# EAGLE design panel446 (EAGLE 7.5.0)

## Sheet 1 of 4: MAIN
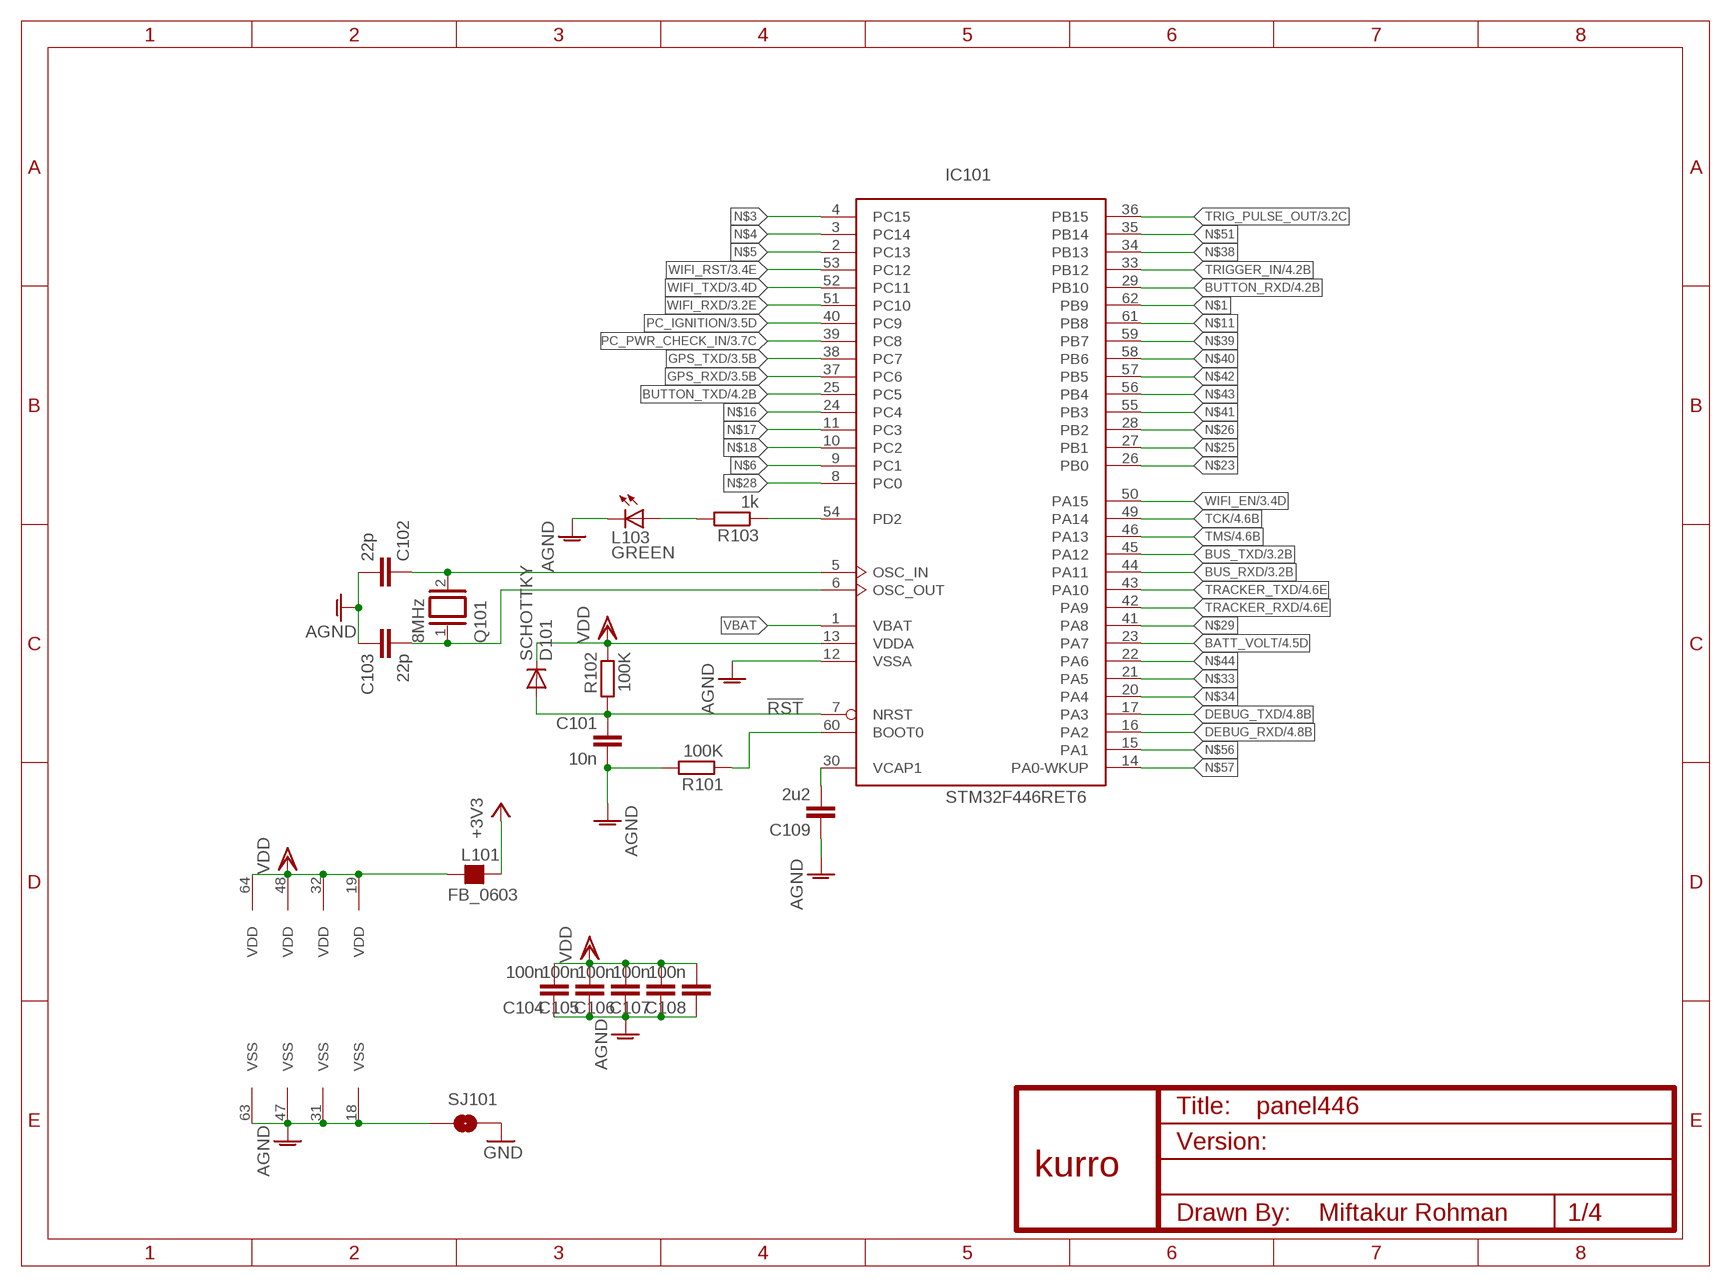
[diagram p0: schematic, sheet 1]

### Parts
C101  10n  C-EUC0603  [C0603]
C102  22p  C-EUC0603  [C0603]
C103  22p  C-EUC0603  [C0603]
C104  100n  C-EUC0603  [C0603]
C105  100n  C-EUC0603  [C0603]
C106  100n  C-EUC0603  [C0603]
C107  100n  C-EUC0603  [C0603]
C108  100n  C-EUC0603  [C0603]
C109  2u2  C-EUC0805  [C0805]
D101  SCHOTTKY  DIODE-MICROMELF-W  [MICROMELF-W]
IC101  STM32F446RET6  STM32F401RBT  [LQFP64]
L101  FB_0603  [L0603]
L103  GREEN  LEDCHIP-LED0805  [CHIP-LED0805]
Q101  8MHz  XTAL/S  [QS]
R101  100K  R-EU_R0603  [R0603]
R102  100K  R-EU_R0603  [R0603]
R103  1k  R-EU_R0603  [R0603]
SJ101  SOLDERJUMPERTRACE  [SJ_2S-TRACE]
U$1  KURRO_FOOTPRINT  [KURRO-LOGO]

### Nets
!RST [ic]: C101.1 D101.A IC101.7(NRST) R102.2 ; also sheet 4
+3V3: L101.2 ; also sheet 2,4
AGND [ic]: C101.2 C102.2 C103.1 C104.1 C105.1 C106.1 C107.1 C108.1 C109.1 IC101.12(VSSA) IC101.18(VSS) IC101.31(VSS) IC101.47(VSS) IC101.63(VSS) L103.C R101.2 SJ101.1 ; also sheet 3,4
BATT_VOLT [ic]: IC101.23(PA7) ; also sheet 4
BOOT1 [ic]: IC101.60(BOOT0) R101.1
BUS_RXD [ic]: IC101.44(PA11) ; also sheet 3
BUS_TXD [ic]: IC101.45(PA12) ; also sheet 3
BUTTON_RXD [ic]: IC101.29(PB10) ; also sheet 4
BUTTON_TXD [ic]: IC101.25(PC5) ; also sheet 4
DEBUG_RXD [ic]: IC101.16(PA2) ; also sheet 4
DEBUG_TXD [ic]: IC101.17(PA3) ; also sheet 4
GND: SJ101.2 ; also sheet 2,3,4
GPS_RXD [ic]: IC101.37(PC6) ; also sheet 3
GPS_TXD [ic]: IC101.38(PC7) ; also sheet 3
N$1 [ic]: IC101.62(PB9)
N$2 [ic]: C109.2 IC101.30(VCAP1)
N$3 [ic]: IC101.4(PC15)
N$4 [ic]: IC101.3(PC14)
N$5 [ic]: IC101.2(PC13)
N$6 [ic]: IC101.9(PC1)
N$11 [ic]: IC101.61(PB8)
N$16 [ic]: IC101.24(PC4)
N$17 [ic]: IC101.11(PC3)
N$18 [ic]: IC101.10(PC2)
N$19 [ic]: IC101.54(PD2) R103.1
N$20 [ic]: L103.A R103.2
N$23 [ic]: IC101.26(PB0)
N$24 [ic]: C103.2 IC101.6(OSC_OUT) Q101.1
N$25 [ic]: IC101.27(PB1)
N$26 [ic]: IC101.28(PB2)
N$28 [ic]: IC101.8(PC0)
N$29 [ic]: IC101.41(PA8)
N$31 [ic]: C102.1 IC101.5(OSC_IN) Q101.2
N$33 [ic]: IC101.21(PA5)
N$34 [ic]: IC101.20(PA4)
N$38 [ic]: IC101.34(PB13)
N$39 [ic]: IC101.59(PB7)
N$40 [ic]: IC101.58(PB6)
N$41 [ic]: IC101.55(PB3)
N$42 [ic]: IC101.57(PB5)
N$43 [ic]: IC101.56(PB4)
N$44 [ic]: IC101.22(PA6)
N$51 [ic]: IC101.35(PB14)
N$56 [ic]: IC101.15(PA1)
N$57 [ic]: IC101.14(PA0-WKUP)
PC_IGNITION [ic]: IC101.40(PC9) ; also sheet 3
PC_PWR_CHECK_IN [ic]: IC101.39(PC8) ; also sheet 3
TCK [ic]: IC101.49(PA14) ; also sheet 4
TMS [ic]: IC101.46(PA13) ; also sheet 4
TRACKER_RXD [ic]: IC101.42(PA9) ; also sheet 4
TRACKER_TXD [ic]: IC101.43(PA10) ; also sheet 4
TRIG_PULSE_OUT [ic]: IC101.36(PB15) ; also sheet 3
TRIGGER_IN [ic]: IC101.33(PB12) ; also sheet 4
VBAT [ic]: IC101.1(VBAT)
VDD [ic]: C104.2 C105.2 C106.2 C107.2 C108.2 D101.C IC101.13(VDDA) IC101.19(VDD) IC101.32(VDD) IC101.48(VDD) IC101.64(VDD) L101.1 R102.1 ; also sheet 3,4
WIFI_EN [ic]: IC101.50(PA15) ; also sheet 3
WIFI_RST [ic]: IC101.53(PC12) ; also sheet 3
WIFI_RXD [ic]: IC101.51(PC10) ; also sheet 3
WIFI_TXD [ic]: IC101.52(PC11) ; also sheet 3

## Sheet 2 of 4
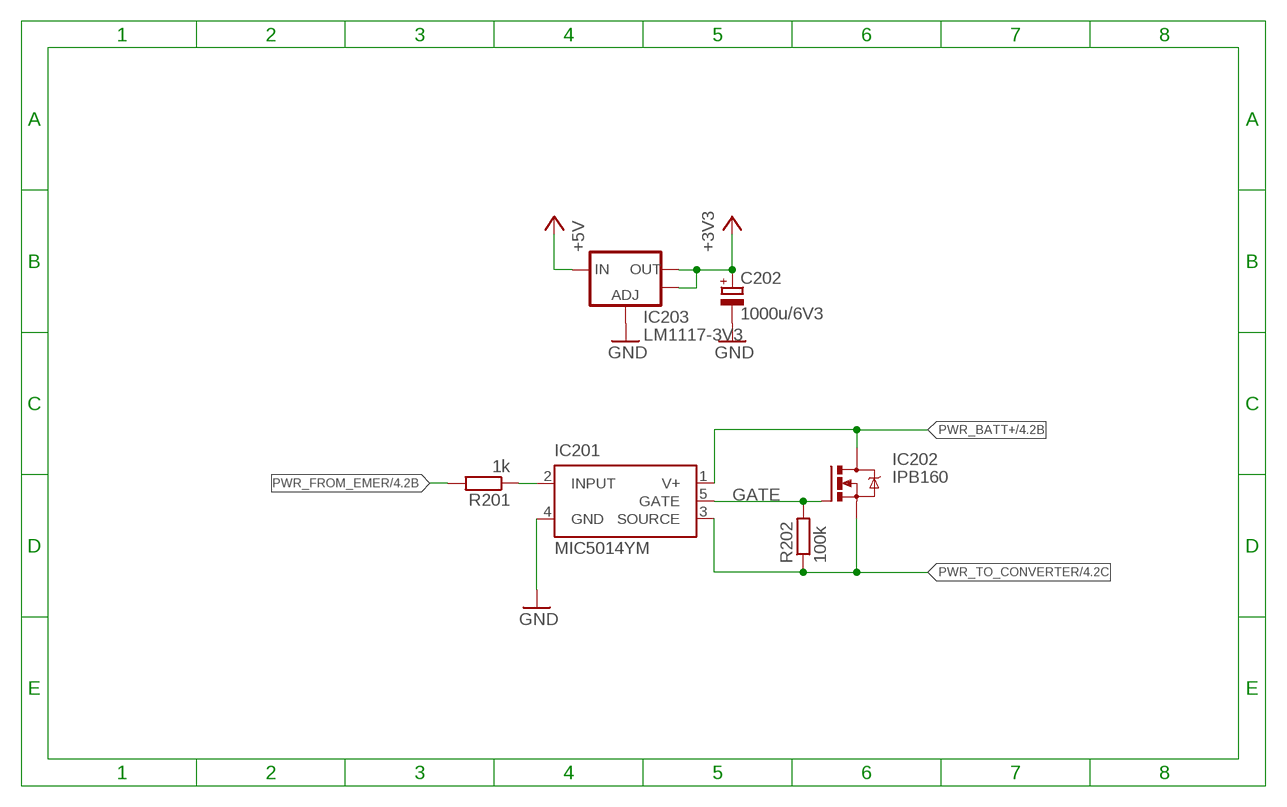
[diagram p1: schematic, sheet 2]

### Parts
C202  1000u/6V3  CPOL-EU153CLV-0810  [153CLV-0810]
IC201  MIC5014YM  [SO-08]
IC202  IPB160  [PG-TO263-7]
IC203  LM1117-3V3  V_REG_LM1117SOT223  [SOT223]
R201  1k  R-EU_R0603  [R0603]
R202  100k  R-EU_R0603  [R0603]

### Nets
+3V3: C202.+ IC203.2(OUT) IC203.4(OUT) ; also sheet 1,4
+5V: IC203.3(IN) ; also sheet 3,4
GATE: IC201.5(GATE) IC202.1(G) R202.2
GND: C202.- IC201.4(GND) IC203.1(ADJ) ; also sheet 1,3,4
N$69: IC201.2(INPUT) R201.1
PWR_BATT+ [power]: IC201.1(V+) IC202.4(D) ; also sheet 4
PWR_FROM_EMER [power]: R201.2 ; also sheet 4
PWR_TO_CONVERTER [power]: IC201.3(SOURCE) IC202.2(S) IC202.3(S) IC202.5(S) IC202.6(S) IC202.7(S) R202.1 ; also sheet 4

## Sheet 3 of 4
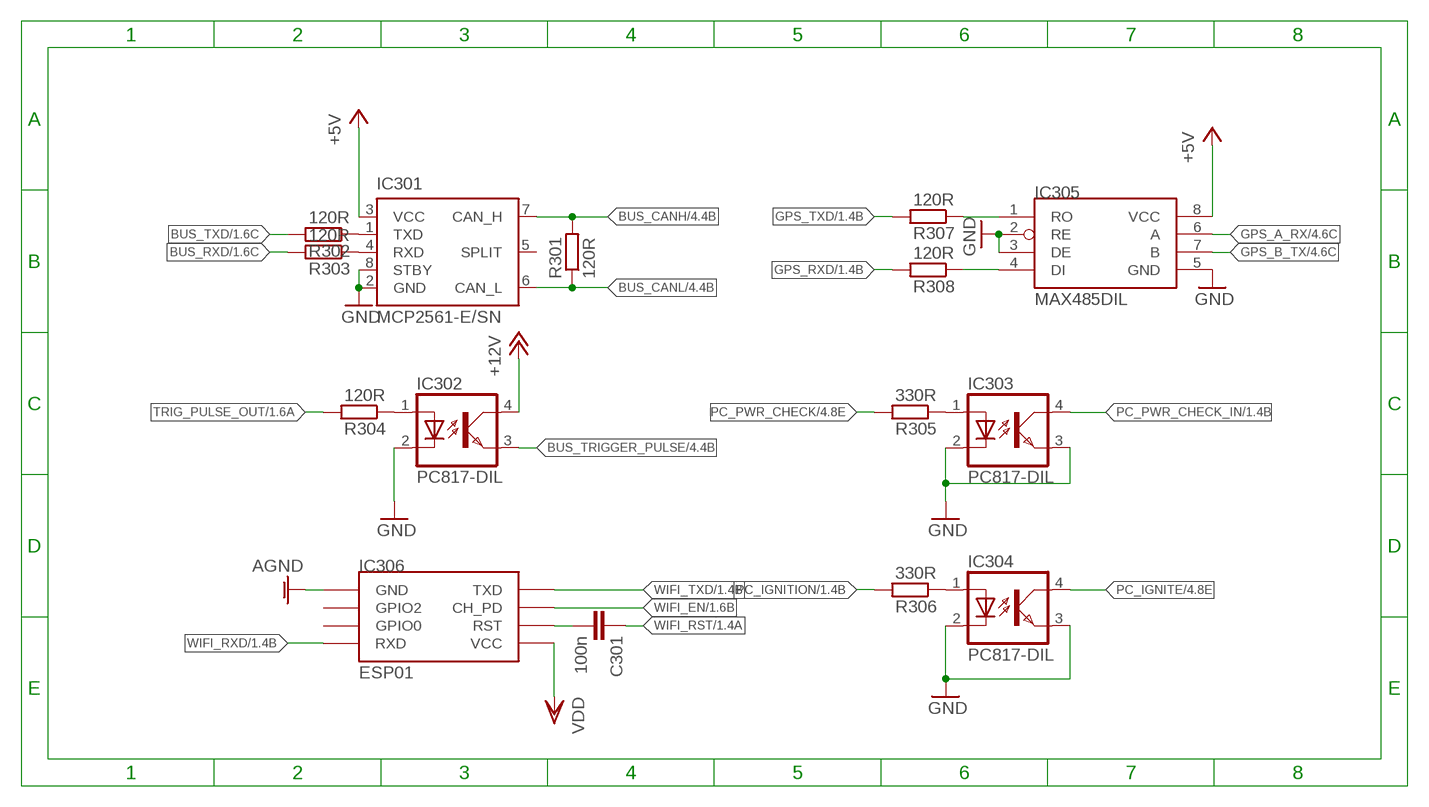
[diagram p2: schematic, sheet 3]

### Parts
C301  100n  C-EUC0603  [C0603]
IC301  MCP2561-E/SN  [SOIC-8]
IC302  PC817-DIL  [DIL04A]
IC303  PC817-DIL  [DIL04A]
IC304  PC817-DIL  [DIL04A]
IC305  MAX485DIL  [DIL08]
IC306  ESP01  [ESP01]
R301  120R  R-EU_R0603  [R0603]
R302  120R  R-EU_R0603  [R0603]
R303  120R  R-EU_R0603  [R0603]
R304  120R  R-EU_R0603  [R0603]
R305  330R  R-EU_R0603  [R0603]
R306  330R  R-EU_R0603  [R0603]
R307  120R  R-EU_R0603  [R0603]
R308  120R  R-EU_R0603  [R0603]

### Nets
+5V: IC301.3(VCC) IC305.8(VCC) ; also sheet 2,4
+12V [power]: IC302.4(COL) ; also sheet 4
AGND [ic]: IC306.GND ; also sheet 1,4
BUS_CANH: IC301.7(CAN_H) R301.2 ; also sheet 4
BUS_CANL: IC301.6(CAN_L) R301.1 ; also sheet 4
BUS_RXD [ic]: R303.2 ; also sheet 1
BUS_TRIGGER_PULSE: IC302.3(EMIT) ; also sheet 4
BUS_TXD [ic]: R302.2 ; also sheet 1
GND: IC301.2(GND) IC301.8(STBY) IC302.2(C) IC303.2(C) IC303.3(EMIT) IC304.2(C) IC304.3(EMIT) IC305.2(RE) IC305.3(DE) IC305.5(GND) ; also sheet 1,2,4
GPS_A_RX: IC305.6(A) ; also sheet 4
GPS_B_TX: IC305.7(B) ; also sheet 4
GPS_RXD [ic]: R308.2 ; also sheet 1
GPS_TXD [ic]: R307.2 ; also sheet 1
N$9: C301.2 IC306.RST
N$46: IC301.4(RXD) R303.1
N$49: IC301.1(TXD) R302.1
N$50: IC302.1(A) R304.1
N$58: IC303.1(A) R305.1
N$59: IC305.1(RO) R307.1
N$60: IC305.4(DI) R308.1
N$68: IC304.1(A) R306.1
PC_IGNITE: IC304.4(COL) ; also sheet 4
PC_IGNITION [ic]: R306.2 ; also sheet 1
PC_PWR_CHECK: R305.2 ; also sheet 4
PC_PWR_CHECK_IN [ic]: IC303.4(COL) ; also sheet 1
TRIG_PULSE_OUT [ic]: R304.2 ; also sheet 1
VDD [ic]: IC306.VCC ; also sheet 1,4
WIFI_EN [ic]: IC306.CH_PD ; also sheet 1
WIFI_RST [ic]: C301.1 ; also sheet 1
WIFI_RXD [ic]: IC306.RX(RXD) ; also sheet 1
WIFI_TXD [ic]: IC306.TX(TXD) ; also sheet 1
Unconnected: IC301.5(SPLIT) IC306.GPIO0 IC306.GPIO2

## Sheet 4 of 4: CONNECTOR
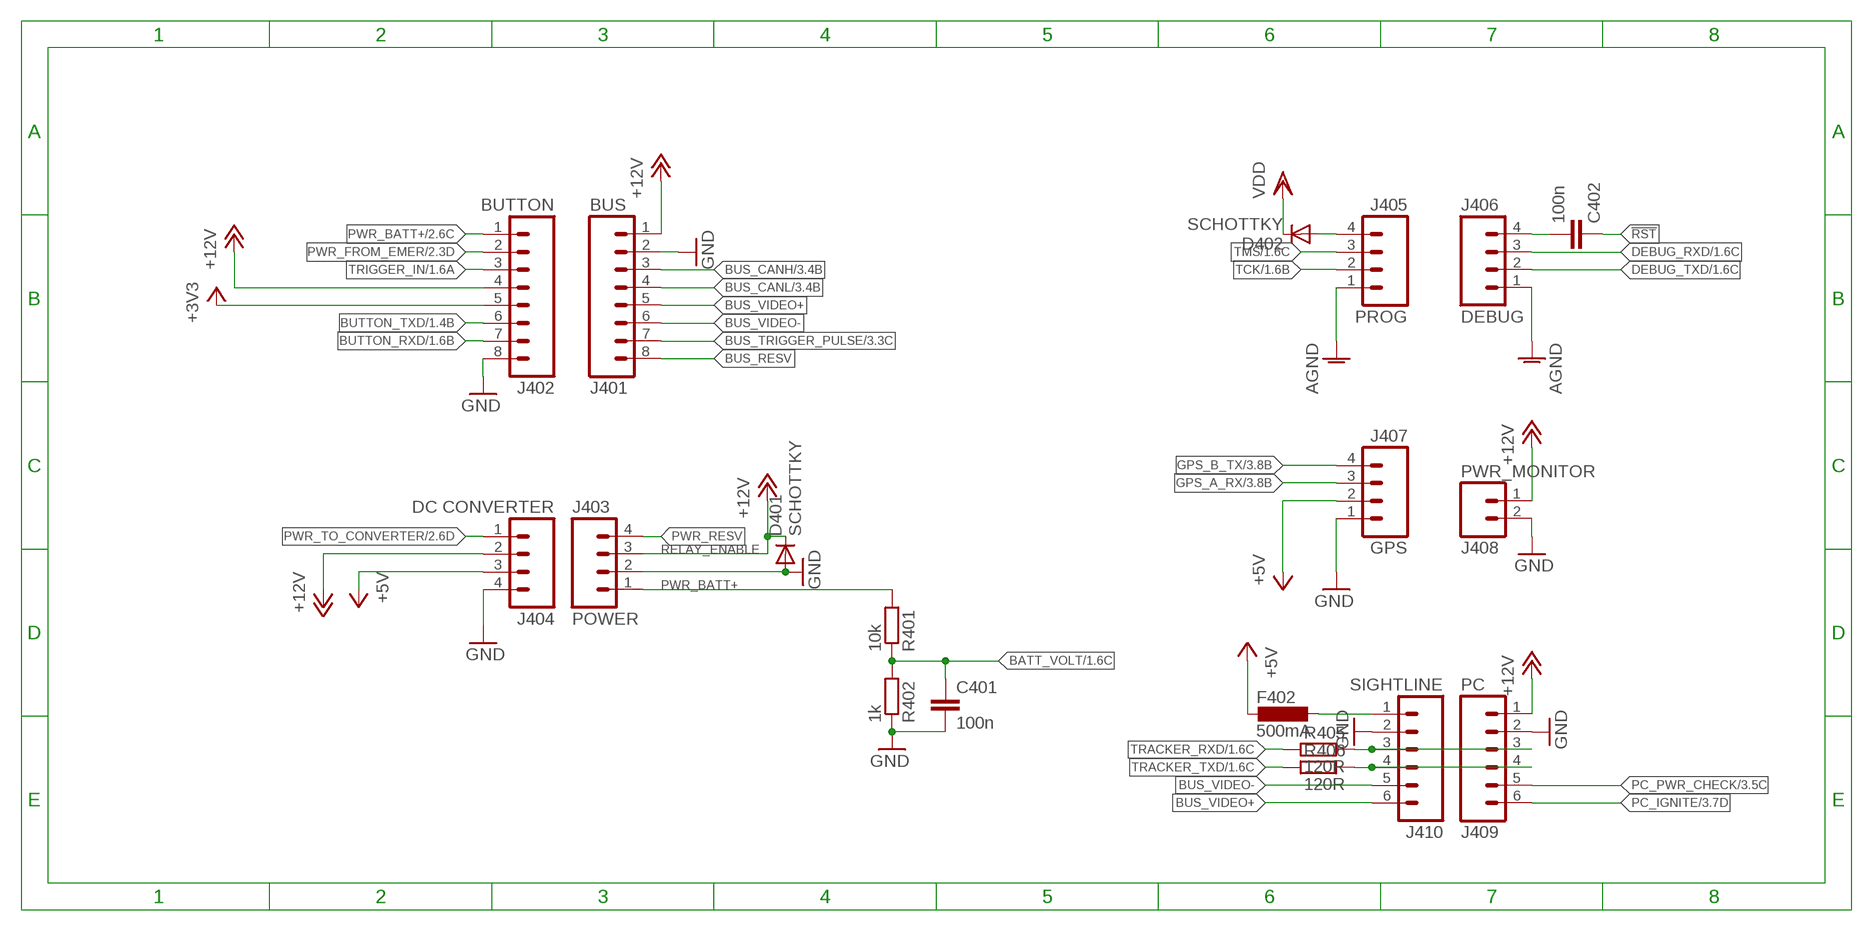
[diagram p3: schematic, sheet 4]

### Parts
C401  100n  C-EUC0603  [C0603]
C402  100n  C-EUC0603  [C0603]
D401  SCHOTTKY  DIODE-MICROMELF-W  [MICROMELF-W]
D402  SCHOTTKY  DIODE-MICROMELF-W  [MICROMELF-W]
F402  500mA  L-EUL0805  [L0805]
J401  BUS  M08-XH-VERT  [XH-8-VERT]
J402  BUTTON  M08-XH-VERT  [XH-8-VERT]
J403  POWER  M04-XH-VERT  [XH-4-VERT]
J404  DC CONVERTER  M04-XH-VERT  [XH-4-VERT]
J405  PROG  M04-XH-VERT  [XH-4-VERT]
J406  DEBUG  M04-XH-VERT  [XH-4-VERT]
J407  GPS  M04-XH-VERT  [XH-4-VERT]
J408  PWR_MONITOR  M02-XH-RA  [XH-2-RA]
J409  PC  M06-XH-VERT  [XH-6-VERT]
J410  SIGHTLINE  M06-XH-VERT  [XH-6-VERT]
R401  10k  R-EU_R0603  [R0603]
R402  1k  R-EU_R0603  [R0603]
R405  120R  R-EU_R0603  [R0603]
R406  120R  R-EU_R0603  [R0603]

### Nets
!RST [ic]: C402.1 ; also sheet 1
+3V3: J402.5 ; also sheet 1,2
+5V: F402.2 J404.3 J407.2 ; also sheet 2,3
+12V [power]: D401.C J401.1 J402.4 J403.3 J404.2 J408.1 J409.1 ; also sheet 3
AGND [ic]: J405.1 J406.1 ; also sheet 1,3
BATT_VOLT [ic]: C401.1 R401.1 R402.2 ; also sheet 1
BUS_CANH: J401.3 ; also sheet 3
BUS_CANL: J401.4 ; also sheet 3
BUS_RESV: J401.8
BUS_TRIGGER_PULSE: J401.7 ; also sheet 3
BUS_VIDEO+: J401.5 J410.6
BUS_VIDEO-: J401.6 J410.5
BUTTON_RXD [ic]: J402.7 ; also sheet 1
BUTTON_TXD [ic]: J402.6 ; also sheet 1
DEBUG_RXD [ic]: J406.3 ; also sheet 1
DEBUG_TXD [ic]: J406.2 ; also sheet 1
GND: C401.2 D401.A J401.2 J402.8 J403.2 J404.4 J407.1 J408.2 J409.2 J410.2 R402.1 ; also sheet 1,2,3
GPS_A_RX: J407.3 ; also sheet 3
GPS_B_TX: J407.4 ; also sheet 3
N$7: J409.3 J410.3 R405.1
N$8: J409.4 J410.4 R406.1
N$45: D402.A J405.4
N$61: C402.2 J406.4
N$65 [ic]: F402.1 J410.1
PC_IGNITE: J409.6 ; also sheet 3
PC_PWR_CHECK: J409.5 ; also sheet 3
PWR_BATT+ [power]: J402.1 J403.1 R401.2 ; also sheet 2
PWR_FROM_EMER [power]: J402.2 ; also sheet 2
PWR_RESV: J403.4
PWR_TO_CONVERTER [power]: J404.1 ; also sheet 2
TCK [ic]: J405.2 ; also sheet 1
TMS [ic]: J405.3 ; also sheet 1
TRACKER_RXD [ic]: R405.2 ; also sheet 1
TRACKER_TXD [ic]: R406.2 ; also sheet 1
TRIGGER_IN [ic]: J402.3 ; also sheet 1
VDD [ic]: D402.C ; also sheet 1,3

### Notes on the sheet
- RELAY_ENABLE

## Library data of the parts
C101-C108 C301 C401 C402 = resistor:C-EU: CAPACITOR, European symbol
C109 = rcl:C-EU: CAPACITOR, European symbol
C202 = resistor:CPOL-EU: POLARIZED CAPACITOR, European symbol
D101 D401 D402 = diode:DIODE-: DIODE
F402 = rcl:L-EU: INDUCTOR, European symbol
IC101 = micro-stm_v3:STM32F401R*T: ARM 32-bit Cortex™-M3 CPU 84 MHz maximum frequency 128 to 256 Kbytes of Flash memory 64 kbytes of SRAM 50 GPIOs 1.7 to 3.6 V application supply
IC201 = microchip:MIC501*
IC202 = infineon:IPB160: IPB160 TO-263-7
IC203 = SparkFun:V_REG_LM1117: Voltage Regulator LM1117 Standard adjustable voltage regulator but in SMD form. Spark Fun Electronics SKU : COM-00595
IC301 = microchip:MCP256*
IC302-IC304 = optocoupler:PC817: SHARP OPTO COUPLER
IC305 = SparkFun:MAX485
IC306 = esp8266modules:ESP01: ESP8266 Wifi module 01
J401 J402 = SparkFun-Connectors:M08: Header 8 Standard 8-pin 0.1" header. Use with straight break away headers (SKU : PRT-00116), right angle break away headers (PRT-00553), swiss pins (PRT-00743), machine pins (PRT-00117), and female headers (PRT-00115).
J403-J407 = SparkFun-Connectors:M04: Header 4 Standard 4-pin 0.1" header. Use with straight break away headers (SKU : PRT-00116), right angle break away headers (PRT-00553), swiss pins (PRT-00743), machine pins (PRT-00117), and female headers (PRT-00115). Molex polarized connector foot print use with SKU : PRT-08231 with associated crimp pins and housings. 1MM SMD Version SKU: PRT-10208
J408 = SparkFun-Connectors:M02: Standard 2-pin 0.1" header. Use with - straight break away headers ( PRT-00116) - right angle break away headers (PRT-00553) - swiss pins (PRT-00743) - machine pins (PRT-00117) - female headers (PRT-00115) Molex polarized connector foot print use with: PRT-08233 with associated crimp pins and housings. 2.54_SCREWTERM for use with PRT-10571. 3.5mm Screw Terminal footprints for PRT-08084 5mm Screw Terminal footprints for use with PRT-08433
J409 J410 = SparkFun-Connectors:M06: Header 6 Standard 6-pin 0.1" header. Use with straight break away headers (SKU : PRT-00116), right angle break away headers (PRT-00553), swiss pins (PRT-00743), machine pins (PRT-00117), and female headers (PRT-00115). Molex polarized connector foot print use with SKU : PRT-08094 with associated crimp pins and housings. NOTES ON THE VARIANTS LOCK and LOCK_LONGPADS... This footprint was designed to help hold the alignment of a through-hole component (i.e. 6-pin header) while soldering it into place. You may notice that each hole has been shifted either up or down by 0.005 of an inch from it's more standard position (which is a perfectly straight line). This slight alteration caused the pins (the squares in the middle) to touch the edges of the holes. Because they are alternating, it causes a "brace" to hold the component in place. 0.005 has proven to be the perfect amount of "off-center" position when using our standard breakaway headers. Although looks a little odd when you look at the bare footprint, once you have a header in there, the alteration is very hard to notice. Also,if you push a header all the way into place, it is covered up entirely on the bottom side. This idea of altering the position of holes to aid alignment will be further integrated into the Sparkfun Library for other footprints. It can help hold any component with 3 or more connection pins.
L101 = rc-master:FB_: FERRITE BEAD
L103 = led:LED: LED OSRAM: - CHIPLED LG R971, LG N971, LY N971, LG Q971, LY Q971, LO R971, LY R971 LH N974, LH R974 LS Q976, LO Q976, LY Q976 LO Q996 - Hyper CHIPLED LW Q18S LB Q993, LB Q99A, LB R99A - SideLED LS A670, LO A670, LY A670, LG A670, LP A670 LB A673, LV A673, LT A673, LW A673 LH A674 LY A675 LS A676, LA A676, LO A676, LY A676, LW A676 LS A679, LY A679, LG A679 - Hyper Micro SIDELED® LS Y876, LA Y876, LO Y876, LY Y876 LT Y87S - SmartLED LW L88C, LW L88S LB L89C, LB L89S, LG L890 LS L89K, LO L89K, LY L89K LS L896, LA L896, LO L896, LY L896 - TOPLED LS T670, LO T670, LY T670, LG T670, LP T670 LSG T670, LSP T670, LSY T670, LOP T670, LYG T670 LG T671, LOG T671, LSG T671 LB T673, LV T673, LT T673, LW T673 LH T674 LS T676, LA T676, LO T676, LY T676, LB T676, LH T676, LSB T676, LW T676 LB T67C, LV T67C, LT T67C, LS T67K, LO T67K, LY T67K, LW E67C LS E67B, LA E67B, LO E67B, LY E67B, LB E67C, LV E67C, LT E67C LW T67C LS T679, LY T679, LG T679 LS T770, LO T770, LY T770, LG T770, LP T770 LB T773, LV T773, LT T773, LW T773 LH T774 LS E675, LA E675, LY E675, LS T675 LS T776, LA T776, LO T776, LY T776, LB T776 LHGB T686 LT T68C, LB T68C - Hyper Mini TOPLED® LB M676 - Mini TOPLED Santana® LG M470 LS M47K, LO M47K, LY M47K Source: http://www.osram.convergy.de LUXEON: - LUMILED® LXK2-PW12-R00, LXK2-PW12-S00, LXK2-PW14-U00, LXK2-PW14-V00 LXK2-PM12-R00, LXK2-PM12-S00, LXK2-PM14-U00 LXK2-PE12-Q00, LXK2-PE12-R00, LXK2-PE12-S00, LXK2-PE14-T00, LXK2-PE14-U00 LXK2-PB12-K00, LXK2-PB12-L00, LXK2-PB12-M00, LXK2-PB14-N00, LXK2-PB14-P00, LXK2-PB14-Q00 LXK2-PR12-L00, LXK2-PR12-M00, LXK2-PR14-Q00, LXK2-PR14-R00 LXK2-PD12-Q00, LXK2-PD12-R00, LXK2-PD12-S00 LXK2-PH12-R00, LXK2-PH12-S00 LXK2-PL12-P00, LXK2-PL12-Q00, LXK2-PL12-R00 Source: www.luxeon.com KINGBRIGHT: KA-3528ASYC Source: www.kingbright.com
Q101 = special:XTAL/S: CRYSTAL
R101-R103 = resistor:R-EU_: RESISTOR, European symbol
R201 R202 R302 R303 R307 R308 R401 R402 R405 R406 = rcl:R-EU_: RESISTOR, European symbol
R301 R304-R306 = rcl:R-EU_: RESISTOR, European symbol; DNP: T
SJ101 = SparkFun:SOLDERJUMPER: Solder Jumper Standard SMD solder jumper. Used to automate production. Two varients : Normally Open and Normally Closed are the same, but have different paste layers. NC will have a large amount of paste and should jumper during reflow.; BOM: EXCLUDE; DNP: T
U$1 = SparkFun:KURRO_FOOTPRINT

## Net classes
0 default: width 0.406 mm, drill 0.59 mm, clearance 0.305 mm
1 ic: width 0.203 mm, drill 0.59 mm, clearance 0.203 mm
2 power: width 0.406 mm, drill 0.79 mm, clearance 0.406 mm

## Board
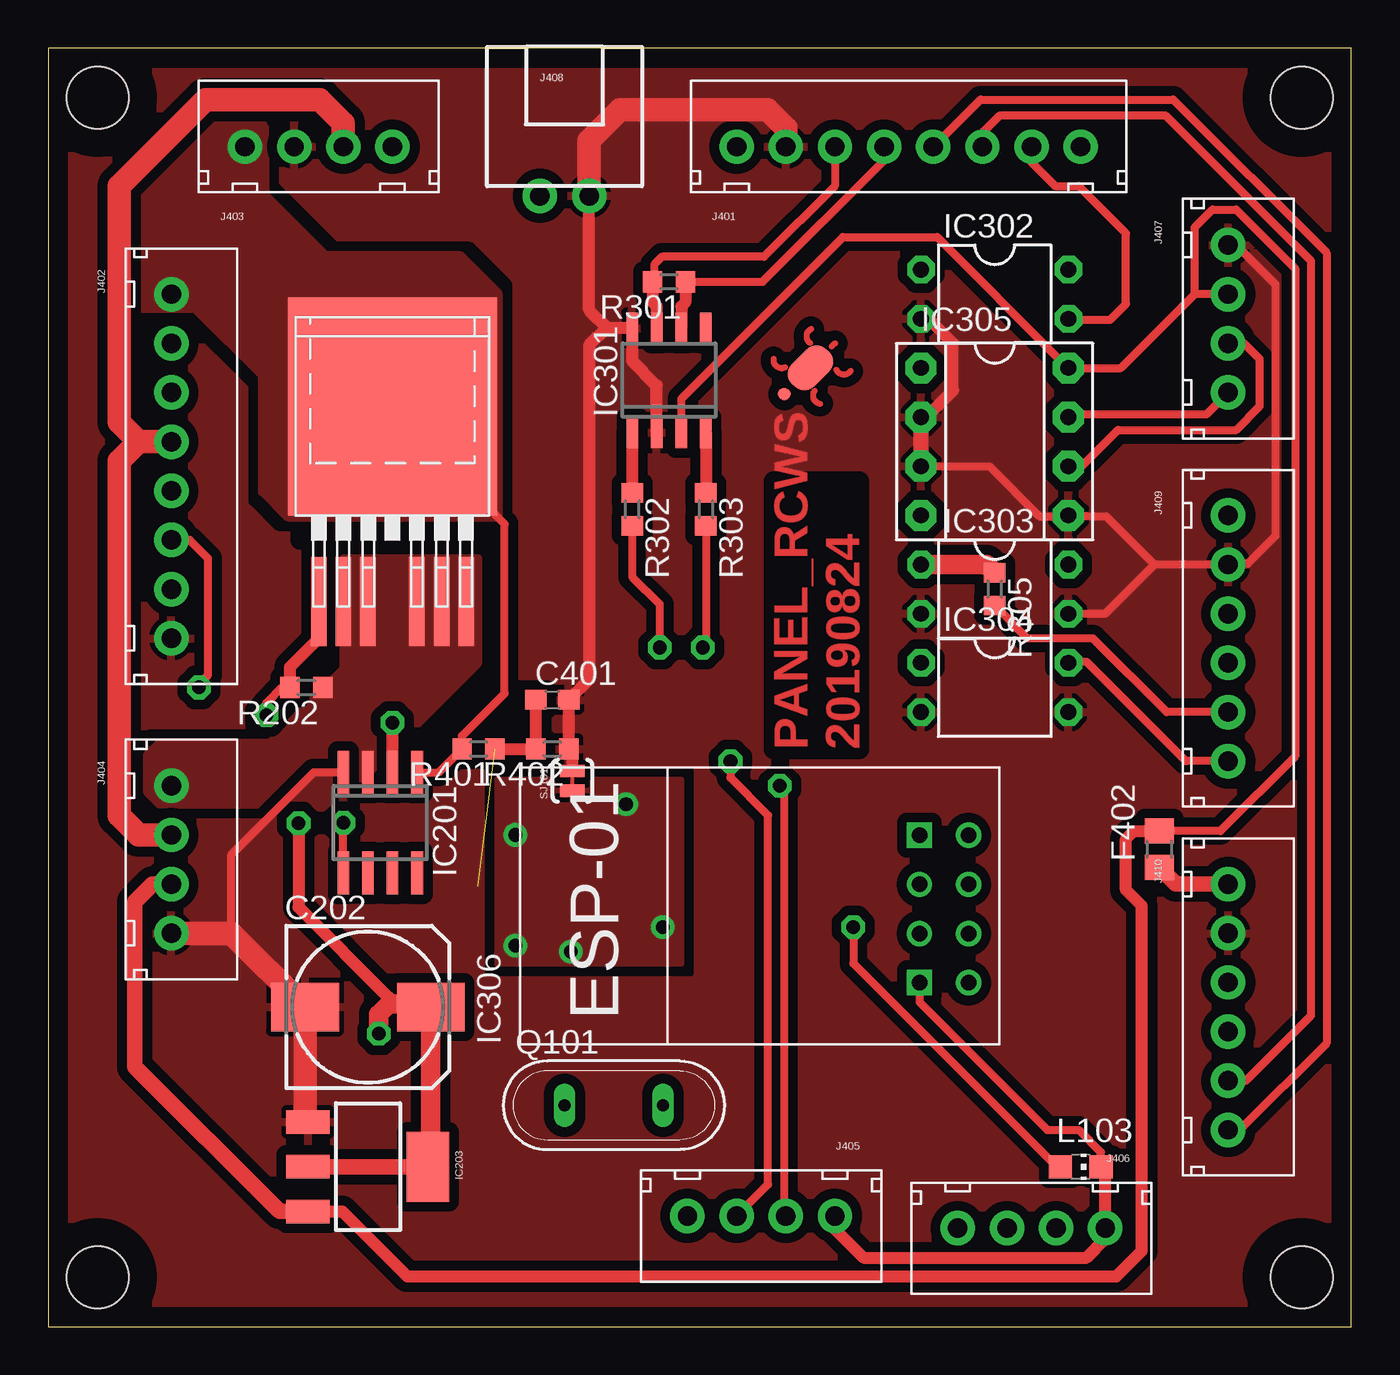
[diagram p4: board, top side]
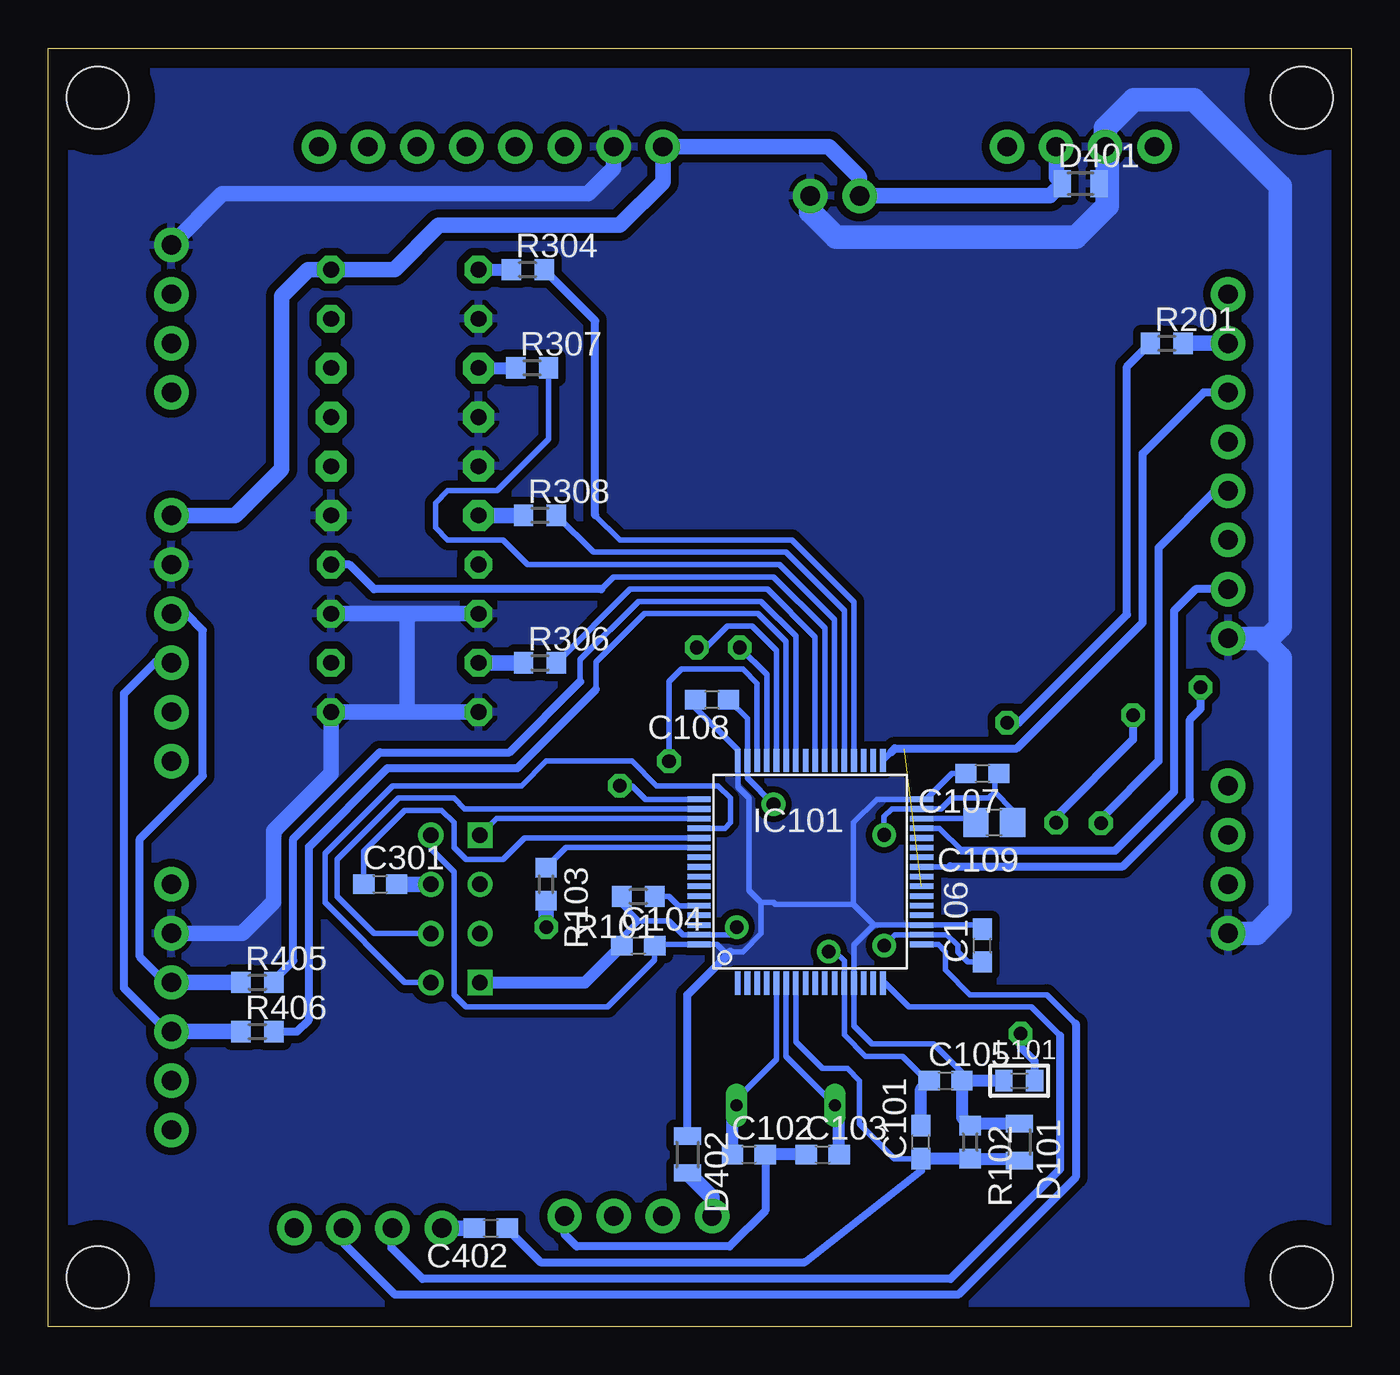
[diagram p5: board, bottom side, seen from below]

Size 67.31 x 66.04 mm. Coordinates in mm from the lower left corner, seen from the top.
Outline: 0,0 67.31,0 67.31,66.04 0,66.04 0,0
Copper layers (1*16): Top 0.035mm / dielectric 1.5mm / Bottom 0.035mm
Design rules "default": minimum track width 10mil, minimum drill 24mil, track to track 8mil, track to pad 8mil, pad to pad 8mil, via to via 8mil, smd to smd 8mil, copper to edge 40mil, drill to drill 8mil, minimum pad ring 10mil, minimum via ring 8mil, stop-mask expansion 4mil, vias tented up to drill 0mil, thermal gap 10mil
Holes 3.2 mm at 2.54,2.54 64.77,2.54 64.77,63.5 2.54,63.5
tRestrict: area 62.2,61 to 67.3,66; area 62.2,0 to 67.3,5.1; area 0,0 to 5.1,5.1; area 0,61 to 5.1,66; area 13,40.6 to 22.8,41
bRestrict: area 0,0 to 5.1,5.1; area 62.2,0 to 67.3,5.1; area 62.2,61 to 67.3,66; area 0,61 to 5.1,66

### Footprints (pad centres in the part's own frame; a part is rotated, then mirrored left to right if it is on the bottom)
C0603 = smd 1.1 x 1: 1 -0.85,0; 2 0.85,0
C0805 = smd 1.3 x 1.5: 1 -0.95,0; 2 0.95,0
153CLV-0810 = smd 3.5 x 2.5: + 3.25,0; - -3.25,0
MICROMELF-W = smd 0.9 x 1.4: A 0.95,0; C -0.95,0
L0805 = smd 1.3 x 1.5: 1 -0.95,0; 2 0.95,0
LQFP64 = smd 0.29 x 1.2: 1 -3.75,-5.75; 2 -3.25,-5.75; 3 -2.75,-5.75; 4 -2.25,-5.75; 5 -1.75,-5.75; 6 -1.25,-5.75; 7 -0.75,-5.75; 8 -0.25,-5.75; 9 0.25,-5.75; 10 0.75,-5.75; 11 1.25,-5.75; 12 1.75,-5.75; 13 2.25,-5.75; 14 2.75,-5.75; 15 3.25,-5.75; 16 3.75,-5.75; 33 3.75,5.75; 34 3.25,5.75; 35 2.75,5.75; 36 2.25,5.75; 37 1.75,5.75; 38 1.25,5.75; 39 0.75,5.75; 40 0.25,5.75; 41 -0.25,5.75; 42 -0.75,5.75; 43 -1.25,5.75; 44 -1.75,5.75; 45 -2.25,5.75; 46 -2.75,5.75; 47 -3.25,5.75; 48 -3.75,5.75 | smd 1.2 x 0.29: 17 5.75,-3.75; 18 5.75,-3.25; 19 5.75,-2.75; 20 5.75,-2.25; 21 5.75,-1.75; 22 5.75,-1.25; 23 5.75,-0.75; 24 5.75,-0.25; 25 5.75,0.25; 26 5.75,0.75; 27 5.75,1.25; 28 5.75,1.75; 29 5.75,2.25; 30 5.75,2.75; 31 5.75,3.25; 32 5.75,3.75; 49 -5.75,3.75; 50 -5.75,3.25; 51 -5.75,2.75; 52 -5.75,2.25; 53 -5.75,1.75; 54 -5.75,1.25; 55 -5.75,0.75; 56 -5.75,0.25; 57 -5.75,-0.25; 58 -5.75,-0.75; 59 -5.75,-1.25; 60 -5.75,-1.75; 61 -5.75,-2.25; 62 -5.75,-2.75; 63 -5.75,-3.25; 64 -5.75,-3.75
SO-08 = smd 0.6 x 2.2: 1 -1.905,-2.6; 2 -0.635,-2.6; 3 0.635,-2.6; 4 1.905,-2.6; 5 1.905,2.6; 6 0.635,2.6; 7 -0.635,2.6; 8 -1.905,2.6
PG-TO263-7 = smd 0.8 x 4.6: 1 -3.81,-4.45; 2 -2.54,-4.45; 3 -1.27,-4.45; 5 1.27,-4.45; 6 2.54,-4.45; 7 3.81,-4.45 | smd 10.8 x 11.25: 4 0,5.625
SOT223 = smd 1.219 x 2.235: 1 -2.311,-3.099; 2 0,-3.099; 3 2.311,-3.099 | smd 3.6 x 2.2: 4 0,3.099
SOIC-8 = smd 0.6 x 1.6: 1 -1.905,-2.7; 2 -0.635,-2.7; 3 0.635,-2.7; 4 1.905,-2.7; 5 1.905,2.7; 6 0.635,2.7; 7 -0.635,2.7; 8 -1.905,2.7
DIL04A = drill 0.813 pad 1.422 octagon: 1 -1.27,-3.81; 2 1.27,-3.81; 3 1.27,3.81; 4 -1.27,3.81
DIL08 = drill 0.813 pad 1.6 octagon: 1 -3.81,-3.81; 2 -1.27,-3.81; 3 1.27,-3.81; 4 3.81,-3.81; 5 3.81,3.81; 6 1.27,3.81; 7 -1.27,3.81; 8 -3.81,3.81
ESP01 = drill 0.8: CH_PD -1.285,-8.178; GPIO0 1.255,-5.638; GPIO2 -1.285,-5.638; RST 1.255,-8.178; TX -3.825,-8.178; VCC 3.795,-8.178 | drill 0.8 square: GND -3.825,-5.638; RX 3.795,-5.638
XH-8-VERT = drill 1 pad 1.778: 1 -8.89,0; 2 -6.35,0; 3 -3.81,0; 4 -1.27,0; 5 1.27,0; 6 3.81,0; 7 6.35,0; 8 8.89,0
XH-4-VERT = drill 1 pad 1.778: 1 -3.81,0; 2 -1.27,0; 3 1.27,0; 4 3.81,0
XH-2-RA = drill 1 pad 1.778: 1 -1.27,0; 2 1.27,0
XH-6-VERT = drill 1 pad 1.778: 1 -6.35,0; 2 -3.81,0; 3 -1.27,0; 4 1.27,0; 5 3.81,0; 6 6.35,0
L0603 = smd 0.9 x 1.1: 1 -0.794,0; 2 0.794,0
CHIP-LED0805 = smd 1.2 x 1.2: A 0,-1.05; C 0,1.05
QS = drill 0.61 long: 1 -2.54,0; 2 2.54,0
R0603 = smd 1 x 1.1: 1 -0.85,0; 2 0.85,0
SJ_2S-TRACE = smd 0.635 x 1.27: 1 -0.508,0; 2 0.508,0
KURRO-LOGO = smd 2.54 x 1.651 rotated 45 bottom: P$1 0,0 | smd 0.635 x 0.635 rotated 45 bottom: P$2 1.347,1.347

### Placement (x,y rotation side)
C101  22.23,9.53 90 bottom
C102  31.11,8.89 0 bottom
C103  27.3,8.89 0 bottom
C104  36.83,19.68 0 bottom
C105  20.95,12.7 0 bottom
C106  19.05,19.68 90 bottom
C107  19.05,28.57 180 bottom
C108  33.02,32.38 180 bottom
C109  18.44,26.04 180 bottom
C202  16.51,16.51 0 top
C301  50.16,22.86 0 bottom
C401  26.04,32.38 0 top
C402  44.45,5.08 180 bottom
D101  17.14,9.53 270 bottom
D401  13.97,59.05 0 bottom
D402  34.29,8.89 270 bottom
F402  57.4,24.66 90 top
IC101  27.94,23.5 0 bottom
IC201  17.14,26.04 180 top
IC202  17.78,41.91 0 top
IC203  16.51,8.26 270 top
IC301  32.07,48.9 0 top
IC302  48.9,53.34 270 top
IC303  48.9,38.1 270 top
IC304  48.9,33.02 270 top
IC305  48.9,45.72 270 top
IC306  39.37,21.59 90 top
J401  44.45,60.96 0 top
J402  6.35,44.45 270 top
J403  13.97,60.96 0 top
J404  6.35,24.13 270 top
J405  36.83,5.71 180 top
J406  50.8,5.08 180 top
J407  60.96,52.07 270 top
J408  26.67,58.42 0 top
J409  60.96,35.56 270 top
J410  60.96,16.51 270 top
L101  17.14,12.7 0 bottom
L103  53.34,8.26 270 top
Q101  29.21,11.43 0 top
R101  36.83,22.23 180 bottom
R102  19.68,9.53 270 bottom
R103  41.59,22.86 270 bottom
R201  9.53,50.8 0 bottom
R202  13.34,33.02 180 top
R301  32.07,53.98 180 top
R302  30.16,42.23 270 top
R303  33.97,42.23 270 top
R304  42.55,54.61 0 bottom
R305  48.9,38.1 270 top
R306  41.91,34.29 0 bottom
R307  42.32,49.53 0 bottom
R308  41.91,41.91 0 bottom
R401  22.23,29.84 180 top
R402  26.04,29.84 180 top
R405  56.52,17.78 0 bottom
R406  56.52,15.24 0 bottom
SJ101  27.08,28.19 90 top
U$1  39.37,49.53 270 bottom

### Tracks (layer width: path | path; a pad name or v marks a point on that pad's centre or on a via)
!RST
  Bottom 0.279: IC101.7 28.69,14.72 27.3,13.34 26.04,13.34 25.4,12.7 25.4,10.48 23.6,8.68 C101.1
  Bottom 0.406: C402.1 43.6,5.04 41.88,3.33 28.22,3.33 22.23,8.05 C101.1
  Bottom 0.61: D101.A 17.25,8.68 R102.2 C101.1
+3V3  (via drill 0.7 pad 1.22)
  Top 0.61: 17.61,16.66 17.61,16.99 12.93,21.68 v12.93,26.01
  Top 0.813: IC203.2 IC203.4 19.76,8.41
  Top 1.016: 19.76,8.41 C202.+ 19.61,16.66 17.61,16.66 17.07,16.12 v17.07,15.13
  Bottom 0.406: L101.2 16.35,13.71 17.07,14.43 v17.07,15.13 | J402.5 7.01,43.18 9.96,40.23 9.96,29.21 12.93,26.24 v12.93,26.01
+5V
  Top 0.406: IC301.3 32.7,47.94 41.05,56.29 45.92,56.29 52.22,49.99 52.25,49.99 IC305.8 55.42,49.53 59.23,53.34 | 59.23,53.34 59.23,56.79 60.15,57.71 61.37,57.71 64.41,54.66 64.41,29.46 60.55,25.6 57.41,25.6 F402.2 | J407.2 59.23,53.34
  Top 0.61: F402.2 56.08,25.6 55.68,25.2 55.68,22.55 56.49,21.74 56.49,3.91 55.17,2.59 18.54,2.59 15.19,5.94 IC203.3
  Top 0.813: J404.3 5.38,22.86 4.47,21.95 4.47,13.41 11.94,5.94 IC203.3
+12V
  Top 1.219: J404.2 4.67,25.4 3.66,26.42 3.66,44.7 4.67,45.72 | 4.67,45.72 3.66,46.74 3.66,58.93 8.13,63.4 14.02,63.4 15.24,62.18 J403.3 | 4.67,45.72 J402.4
  Bottom 0.813: J403.3 15.24,59.38 D401.C 15.55,58.42 J408.1 25.4,59.37 26.99,60.96 J401.1 35.56,59.13 37.8,56.9 47.14,56.9 49.43,54.61 IC302.4 53.9,54.61 55.27,53.24 55.27,44.3 57.66,41.91 J409.1
AGND  (via drill 0.7 pad 1.22)
  Top 0.406: IC306.GND 45.01,16.77 51.61,10.16 53.24,10.16 54.39,9.01 L103.C
  Top 0.61: J405.1 40.64,5.03 42.11,3.56 53.65,3.56 54.61,4.52 J406.1 54.61,8.04 L103.C
  Bottom 0.279: 36.83,20.95 35.24,20.95 34.53,20.25 IC101.63 32.14,20.25 v31.75,20.64 | 36.83,20.95 37.68,21.8 R101.2 | C104.1 37.68,20.11 36.83,20.95 | C106.1 19.79,18.84 20.32,19.37 20.32,19.68 20.88,20.25 IC101.18 23.57,20.25 v24.13,19.68 | v29.84,26.99 31.19,28.33 IC101.47 31.19,31.41 C108.1 | v24.13,25.4 24.13,26.35 23.74,26.75 IC101.31 21.2,26.75 20.64,27.3 18.73,27.3 18.41,27.62 | v26.99,19.37 26.67,19.37 26.19,18.89 IC101.12 26.19,15.08 25.08,13.97 23.18,13.97 21.91,12.7 C105.1 | 18.41,27.62 18.41,28.36 C107.1 | C109.1 17.49,26.7 18.41,27.62
  Bottom 0.406: C102.2 30.27,5.98 32.11,4.14 40.02,4.14 40.64,4.76 J405.1
  Bottom 0.61: C101.2 22.23,12.28 C105.1 | C104.1 39.6,17.77 IC306.GND | C103.1 C102.2
  pour Top (isolate 0.318, rank 5): 23.18,18.73 32.7,18.73 32.7,28.26 23.18,28.26
BATT_VOLT  (1 unrouted)
  Top 0.61: R401.1 R402.2 C401.1
BOOT1
  Bottom 0.279: IC101.60 34.76,21.75 35.24,22.23 R101.1
BUS_CANH
  Top 0.406: J401.3 40.64,58.93 36.98,55.27 31.7,55.27 31.29,54.86 31.29,54.05 R301.2
  Top 0.61: R301.2 31.22,52.92 31.43,52.7 IC301.7
BUS_CANL
  Top 0.406: J401.4 43.18,60.25 36.91,53.98 R301.1
  Top 0.61: R301.1 32.92,52.92 32.7,52.7 IC301.6
BUS_RXD  (via drill 0.7 pad 1.22)
  Top 0.406: R303.2 33.97,35.24 v33.81,35.08
  Bottom 0.279: IC101.44 29.69,34.93 30.96,36.2 32.23,36.2 33.34,35.08 v33.81,35.08
BUS_TRIGGER_PULSE
  Top 0.406: IC302.3 52.78,52.07 52.83,52.02 54.86,52.02 55.68,52.83 55.68,56.49 53.24,58.93 52.02,58.93 50.8,60.15 J401.7
BUS_TXD  (via drill 0.7 pad 1.22)
  Top 0.406: R302.2 30.16,38.73 31.59,37.31 v31.59,35.08
  Bottom 0.279: IC101.45 30.19,33.68 v31.59,35.08
BUS_VIDEO+
  Top 0.406: J401.5 48.16,63.4 58.12,63.4 66.04,55.47 66.04,14.63 61.57,10.16 J410.6
BUS_VIDEO-
  Top 0.406: J401.6 48.26,61.67 49.17,62.59 57.71,62.59 65.23,55.07 65.23,16.05 61.87,12.7 J410.5
BUTTON_RXD
  Bottom 0.279: IC101.29 21.27,25.75 20.12,24.59
  Bottom 0.406: 20.12,24.59 12.19,24.59 9.14,27.64 9.14,36.98 8.03,38.1 J402.7
BUTTON_TXD  (via drill 0.7 pad 1.22)
  Top 0.406: v7.78,33.02 7.78,33.18 8.26,33.66 8.26,39.69 7.3,40.64 J402.6
  Bottom 0.279: IC101.25 20.76,23.75 20.73,23.77
  Bottom 0.406: 20.73,23.77 11.79,23.77 8.33,27.23 8.33,31.36 7.78,31.91 v7.78,33.02
DEBUG_RXD
  Bottom 0.279: IC101.16 24.09,17.75 22.86,16.51 16.51,16.51 15.04,15.04
  Bottom 0.406: 15.04,15.04 15.04,8.13 20.7,2.46 47.98,2.46 49.58,4.06 49.58,5.03 J406.3
DEBUG_TXD
  Bottom 0.279: IC101.17 21.33,19.75 20.95,19.37 20.95,18.41 19.68,17.14 15.72,17.14 14.22,15.65
  Bottom 0.406: 14.22,15.65 14.22,7.72 20.3,1.65 49.4,1.65 52.02,4.27 52.02,5.03 J406.2
GATE  (via drill 0.7 pad 1.22)
  Top 0.406: IC201.5 v15.24,26.04 | R202.2 12.06,33.02 11.27,32.23 v11.27,31.59
  Top 0.61: IC202.1 13.97,35.56 12.48,34.08 R202.2
  Bottom 0.406: v11.27,31.59 11.27,30.32 15.24,26.35 v15.24,26.04
GND
  Top 0.406: J407.1 61.37,55.88 63.4,53.85 63.4,40.84 61.98,39.42 61.01,39.42 J409.2 57.15,39.37 | 57.15,39.37 54.66,41.86 52.76,41.86 IC305.5 52.65,41.86 51.21,41.86 48.62,44.45 IC305.3 | IC303.3 54.61,36.83 57.15,39.37 | 9.45,20.32 9.45,24.37 13.71,28.64 IC201.4
  Top 0.61: 28.85,51.61 27.94,52.53 27.94,58.93 | 28.85,51.61 27.94,50.7 27.94,33.44 C401.2 R402.1 27.08,29.65 SJ101.2 | 28.85,51.61 30.14,51.61 IC301.8 30.16,49.9 31.43,48.63 IC301.2 | IC305.2 45.36,46.99 46.74,48.36 46.74,50.8 45.47,52.07 IC302.2
  Top 0.813: IC305.2 IC305.3
  Top 1.219: J408.2 27.94,58.93 27.94,61.28 29.53,62.87 37.15,62.87 38.1,61.91 J401.2 | J404.4 9.45,20.32 C202.- 13.26,10.72 IC203.1
  Bottom 0.61: D401.A 12.88,59.05
  Bottom 0.813: J403.2 12.7,59.38 D401.A | J410.2 57.3,20.32 55.68,21.95 55.68,25.6 52.7,28.57 IC304.3 48.77,31.75 | 48.77,31.75 IC304.2 | IC303.3 IC303.2 48.51,36.83 48.77,36.58 48.77,31.75 | J401.2 38.1,59.84 39.42,58.52 58.32,58.52 J407.1
  Bottom 1.219: J404.4 4.88,20.32 3.66,21.54 3.66,34.54 4.67,35.56 J402.8 4.27,35.56 3.66,36.17 3.66,58.93 8.13,63.4 11.21,63.4 12.7,61.91 J403.2 12.6,60.86 12.6,57.91 14.22,56.29 26.62,56.29 27.94,57.61 J408.2
  pour Top (isolate 0.508, rank 6): 0,0 67.31,0 67.31,66.04 0,66.04
  pour Bottom (isolate 0.406, rank 6): 0,0 67.31,0 67.31,66.04 0,66.04
GPS_A_RX
  Top 0.406: IC305.6 53.39,44.45 55.27,46.33 61.37,46.33 62.59,47.55 62.59,49.99 61.77,50.8 J407.3
GPS_B_TX
  Top 0.406: IC305.7 52.7,47.02 52.83,47.14 59.84,47.14 J407.4
GPS_RXD
  Bottom 0.279: IC101.37 26.19,36.98 29.21,40.01 39.16,40.01 R308.2
GPS_TXD
  Bottom 0.279: IC101.38 26.69,36.53 29.53,39.37 42.55,39.37 43.81,40.64 46.67,40.64 47.31,41.27 47.31,42.55 46.67,43.18 44.13,43.18 41.47,45.85 R307.2
N$2
  Bottom 0.279: IC101.30 19.6,26.25 C109.2
N$7
  Bottom 0.406: J410.3 61.27,17.78 62.59,19.1 62.59,25.2 59.33,28.45 59.33,35.97 60.2,36.83 J409.3
  Bottom 0.813: J410.3 R405.1
N$8
  Bottom 0.406: J410.4 61.16,15.24 63.4,17.48 63.4,32.72 61.77,34.34 61.01,34.34 J409.4
  Bottom 0.813: J410.4 R406.1
N$9
  Bottom 0.813: IC306.RST 49.3,22.84 C301.2
N$19
  Bottom 0.279: IC101.54 40.56,24.75 R103.1
N$20  (via drill 0.7 pad 1.22)
  Top 0.406: v41.59,20.64 41.59,18.76 52.09,8.26 L103.A
  Bottom 0.813: R103.2 v41.59,20.64
N$24
  Bottom 0.279: IC101.6 29.19,13.95 Q101.1
  Bottom 0.61: C103.2 26.45,11.21 Q101.1
N$31
  Bottom 0.279: IC101.5 29.69,13.81 31.75,11.75 Q101.2
  Bottom 0.61: C102.1 31.96,11.21 Q101.2
N$45
  Bottom 0.813: J405.4 33.02,6.67 D402.A
N$46
  Top 0.61: IC301.4 R303.1
N$49
  Top 0.61: IC301.1 R302.1
N$50
  Bottom 0.61: IC302.1 R304.1
N$58
  Top 1.016: IC303.1 48.48,39.37 R305.1
N$59
  Bottom 0.61: IC305.1 R307.1
N$60
  Bottom 0.813: R308.1 IC305.4
N$61
  Bottom 0.813: C402.2 J406.4
N$65
  Top 0.813: J410.1 58.26,22.86 F402.1
N$68
  Bottom 0.813: R306.1 IC304.1
N$69  (via drill 0.7 pad 1.22)
  Top 0.61: IC201.2 v17.78,31.2
  Bottom 0.406: v17.78,31.2 17.16,31.2 11.58,36.78 11.58,49.59 R201.1
PC_IGNITE
  Top 0.406: J409.6 58.78,29.21 53.65,34.34 52.76,34.34 IC304.4
PC_IGNITION
  Bottom 0.279: IC101.40 27.69,35.63 30.16,38.1 37.25,38.1 R306.2
PC_PWR_CHECK
  Top 0.406: J409.5 57.78,31.75 53.98,35.56 50.59,35.56 R305.2
PC_PWR_CHECK_IN
  Bottom 0.279: IC101.39 27.19,36.08 29.84,38.73 38.1,38.73 38.73,38.1
  Bottom 0.406: 38.73,38.1 50.48,38.1 51.75,39.37 IC303.4
PWR_BATT+
  Top 0.406: IC201.1 20.16,28.64 R401.2 21.38,30.52 23.57,32.72 23.57,41.45 18.69,46.33 18.69,46.62 IC202.4
  pour Top (isolate 0.508, no thermals): 4.45,52.7 7.62,52.7 11.11,49.21 11.11,43.18 12.38,41.91 23.18,41.91 23.18,53.34 21.27,55.24 14.29,55.24 11.11,58.42 11.11,61.91 10.48,62.55 9.21,62.55 4.45,57.78
PWR_FROM_EMER
  Bottom 0.813: R201.2 J402.2
PWR_TO_CONVERTER
  pour Top (isolate 0.508, rank 2, no thermals): 5.08,27.62 5.71,26.99 14.92,26.99 22.23,34.29 22.23,39.69 15.24,39.69 15.24,33.97 11.43,30.16 5.71,30.16 5.08,29.53
TCK  (via drill 0.7 pad 1.22)
  Top 0.406: v37.78,27.94 38,27.72 38,5.82 J405.2
  Bottom 0.279: IC101.49 36.45,27.25 37.15,27.94 v37.78,27.94
TMS  (via drill 0.7 pad 1.22)
  Top 0.406: v35.24,29.21 35.24,28.36 37.19,26.42 37.19,7.34 J405.3
  Bottom 0.279: IC101.46 30.69,33.23 31.43,33.97 34.61,33.97 35.24,33.34 v35.24,29.21
TRACKER_RXD
  Bottom 0.279: IC101.42 28.69,35.67 30.48,37.47 36.83,37.47 39.83,34.47 39.83,33.33
  Bottom 0.406: R405.2 55.66,17.89 54.66,18.9 54.66,25.2 50.19,29.67 43.48,29.67 39.83,33.33
TRACKER_TXD
  Bottom 0.279: IC101.43 29.19,35.38 30.64,36.83 36.51,36.83 39.01,34.33 39.01,32.92
  Bottom 0.406: R406.2 54.46,15.24 53.85,15.85 53.85,24.79 49.78,28.85 43.08,28.85 39.01,32.92
TRIG_PULSE_OUT
  Bottom 0.279: IC101.36 25.69,37.44 28.89,40.64 37.78,40.64 39.05,41.91
  Bottom 0.406: 39.05,41.91 39.05,51.97 R304.2
TRIGGER_IN
  Bottom 0.279: IC101.33 23.77,29.67
  Bottom 0.406: 23.77,29.67 23.57,29.87 17.27,29.87 10.77,36.37 10.77,45.11 7.62,48.26 J402.3
VDD
  Bottom 0.279: C106.2 19.26,20.75 IC101.19 24.66,20.75 | IC306.VCC 47.55,24.69 46.35,23.5 46.35,17.14 45.72,16.51 38.42,16.51 35.98,18.95 C104.2 35.92,19.75 IC101.64 32.76,19.75 32.38,19.37 32.07,19.37 31.43,19.37 30.48,20.32 30.48,21.91 | 24.66,20.75 25.69,19.71 IC101.13 25.69,15.53 24.77,14.61 21.59,14.61 20.11,13.12 C105.2 | 25.72,21.8 25.72,26.04 24.51,27.25 IC101.32 21.97,27.25 20.64,28.57 C107.2 | 25.72,21.8 24.66,20.75 | 30.48,21.91 31.11,22.54 31.11,27.3 31.69,27.88 IC101.48 31.69,29.79 33.87,31.96 C108.2 | 25.72,21.8 29.74,21.8 29.84,21.91 30.48,21.91
  Bottom 0.406: D402.C 34.29,17.14 32.07,19.37
  Bottom 0.61: D101.C 19.59,10.47 R102.1 20.11,10.79 C105.2 L101.1
  pour Bottom (isolate 0.318, rank 2): 23.18,18.73 32.7,18.73 32.7,28.26 23.18,28.26
WIFI_EN
  Bottom 0.279: IC306.CH_PD 47.56,20.32 50.48,20.32 52.39,22.23 52.39,24.13 49.21,27.3 46.35,27.3 45.8,26.75 IC101.50
WIFI_RST
  Bottom 0.279: C301.1 51.02,24.55 48.9,26.67 46.99,26.67 46.35,26.04 46.35,24.77 45.72,24.13 43.81,24.13 42.7,25.25 IC101.53
WIFI_RXD
  Bottom 0.279: IC101.51 44.15,26.25 IC306.RX
WIFI_TXD
  Bottom 0.279: IC101.52 32.36,25.75 32.07,26.04 32.07,27.3 32.7,27.94 35.88,27.94 37.15,29.21 41.59,29.21 42.86,27.94 49.53,27.94 53.02,24.45 53.02,21.91 48.9,17.78 47.56,17.78 IC306.TX

### Text on the board
Top: PANEL_RCWS / 20190824